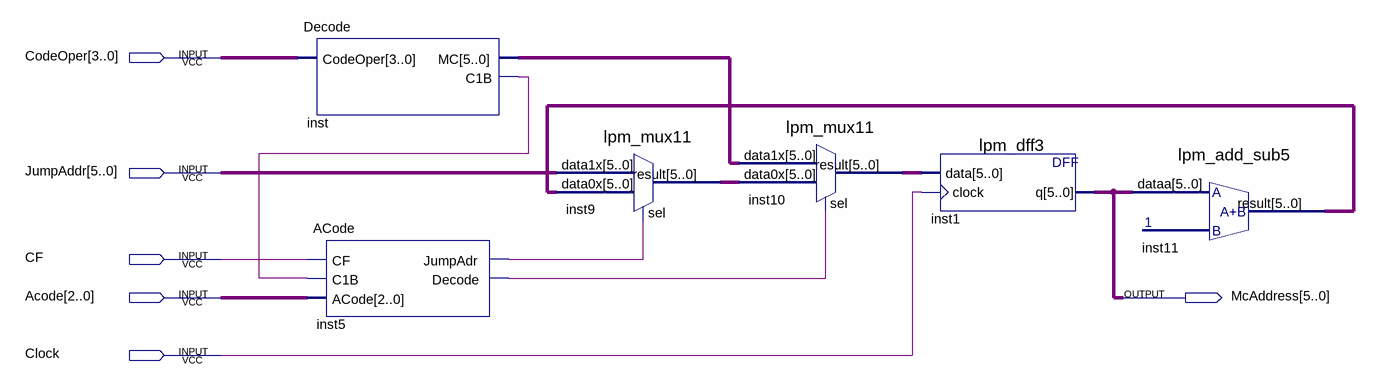
[diagram p0: schematic sheet]
// Quartus schematic SFA.bdf as structural Verilog: 6 symbols, 6 pins
module SFA (
  input  [3:0] CodeOper,
  input  [5:0] JumpAddr,
  input  CF,
  input  [2:0] Acode,
  input  Clock,
  output [5:0] McAddress
);

  wire inst5_decode, inst5_jumpadr, inst_c1b;
  wire [5:0] inst9_result, inst10_result, inst11_result, inst_mc;

  Decode inst (.CodeOper(CodeOper), .MC(inst_mc), .C1B(inst_c1b));
  ACode inst5 (.CF(CF), .C1B(inst_c1b), .ACode(Acode), .JumpAdr(inst5_jumpadr), .Decode(inst5_decode));
  lpm_mux11 inst9 (.data1x(JumpAddr), .data0x(inst11_result), .sel(inst5_jumpadr), .result(inst9_result));
  lpm_mux11 inst10 (.data1x(inst_mc), .data0x(inst9_result), .sel(inst5_decode), .result(inst10_result));
  lpm_dff3 inst1 (.data(inst10_result), .clock(Clock), .q(McAddress));
  lpm_add_sub5 inst11 (.dataa(McAddress), .result(inst11_result));
endmodule
